# Altium schematic sheet [10]USBSPIBridge.SchDoc
size A4
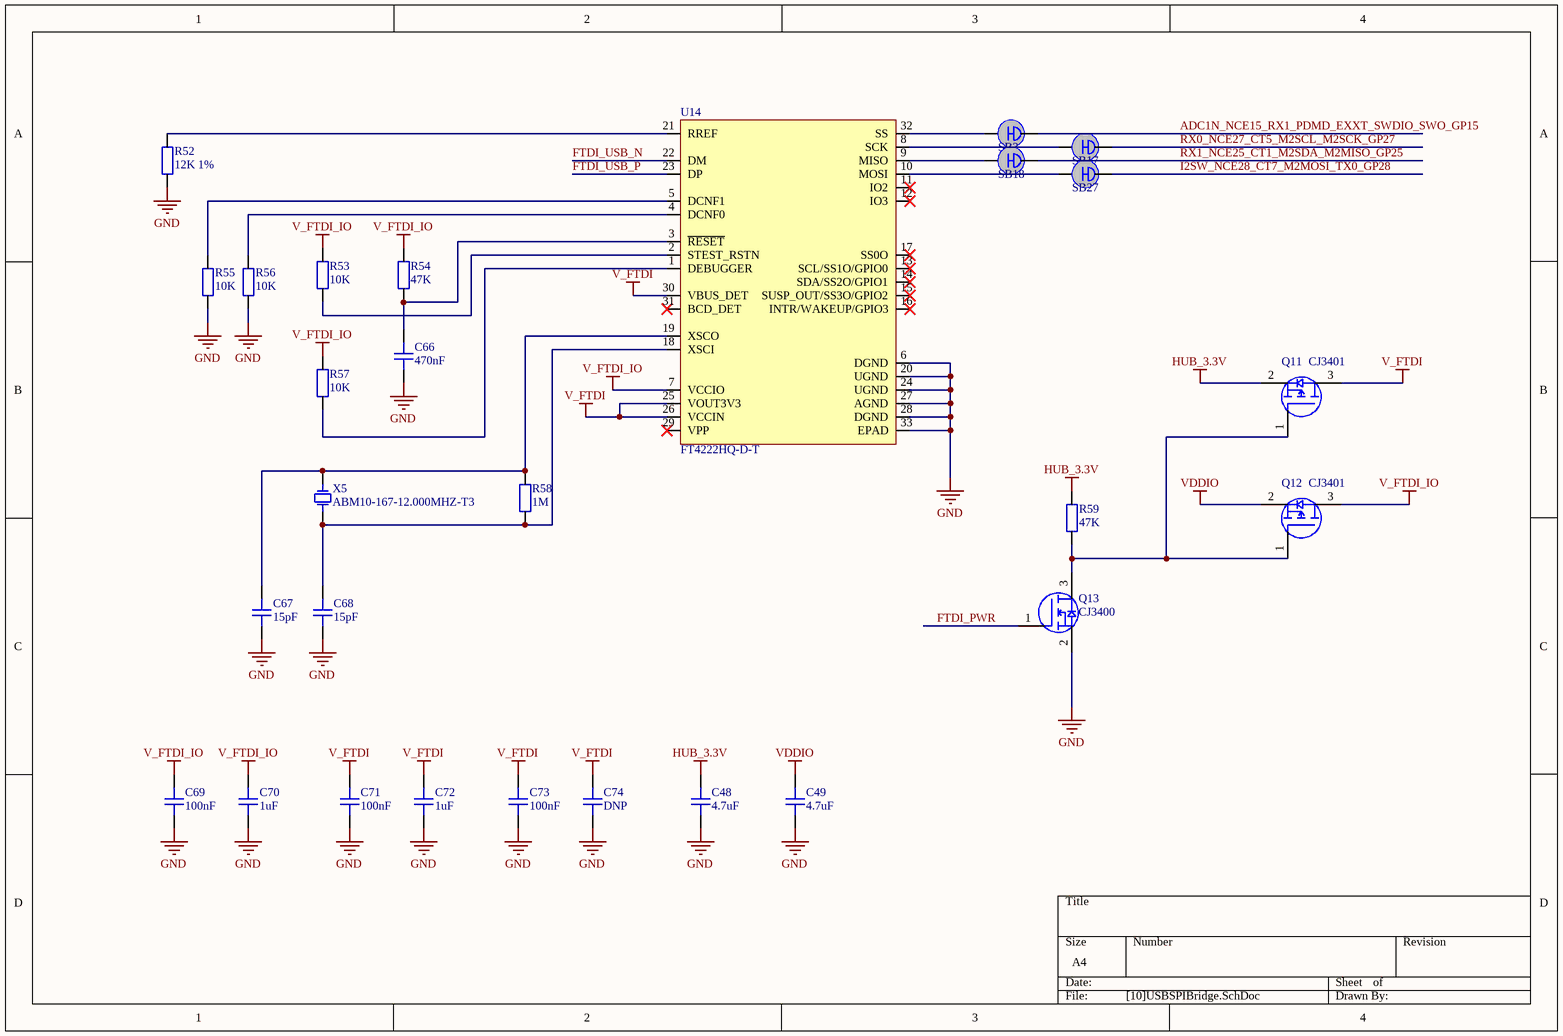
[diagram p0: [10]USBSPIBridge.SchDoc]

## Parts
C48  4.7uF  [CAPC1005L]
C49  4.7uF  [CAPC1005L]
C66  470nF  [CAPC1005L]
C67  15pF  [CAPC1005L]
C68  15pF  [CAPC1005L]
C69  100nF  [CAPC1005L]
C70  1uF  [CAPC1005L]
C71  100nF  [CAPC1005L]
C72  1uF  [CAPC1005L]
C73  100nF  [CAPC1005L]
C74  DNP  [CAPC1005L]
Q11  CJ3401  [SOT23-3L]
Q12  CJ3401  [SOT23-3L]
Q13  CJ3400  [SOT23-3L]
R52  12K 1%  [RESC1005L]
R53  10K  [RESC1005L]
R54  47K  [RESC1005L]
R55  10K  [RESC1005L]
R56  10K  [RESC1005L]
R57  10K  [RESC1005L]
R58  1M  [RESC1005L]
R59  47K  [RESC1005L]
SB3  SBS  [SBS]  (value not drawn)  (net tie, no BOM)
SB17  SBS  [SBS]  (value not drawn)  (net tie, no BOM)
SB18  SBS  [SBS]  (value not drawn)  (net tie, no BOM)
SB27  SBS  [SBS]  (value not drawn)  (net tie, no BOM)
U14  FT4222HQ-D-T  [QFN50P500X500-32W2N]
X5  ABM10-167-12.000MHZ-T3  [OSCCC200X250X100]

## Nets
GND: C48.1 C49.1 C66.1 C67.2 C68.2 C69.1 C70.1 C71.1 C72.1 C73.1 C74.1 Q13.2 R52.1 R55.1 R56.1 U14.6(DGND) U14.20(UGND) U14.24(UGND) U14.27(AGND) U14.28(DGND) U14.33(EPAD) X5.2 X5.4
HUB_3.3V: C48.2 Q11.2 R59.2
V_FTDI: C71.2 C72.2 C73.2 C74.2 Q11.3 U14.25(VOUT3V3) U14.26(VCCIN) U14.30(VBUS_DET)
V_FTDI_IO: C69.2 C70.2 Q12.3 R53.2 R54.2 R57.2 U14.7(VCCIO)
VDDIO: C49.2 Q12.2
ADC1N_NCE15_RX1_PDMD_EXXT_SWDIO_SWO_GP15: SB3.2
FTDI_PWR: Q13.1
FTDI_USB_N: U14.22(DM)
FTDI_USB_P: U14.23(DP)
I2SW_NCE28_CT7_M2MOSI_TX0_GP28: SB27.2
RX0_NCE27_CT5_M2SCL_M2SCK_GP27: SB17.2
RX1_NCE25_CT1_M2SDA_M2MISO_GP25: SB18.2
NetC66_2: C66.2 R54.1 U14.3(~{RESET})
NetC67_1: C67.1 R58.2 U14.19(XSCO) X5.1
NetC68_1: C68.1 R58.1 U14.18(XSCI) X5.3
NetQ11_1: Q11.1 Q12.1 Q13.3 R59.1
NetR52_2: R52.2 U14.21(RREF)
NetR53_1: R53.1 U14.2(STEST_RSTN)
NetR55_2: R55.2 U14.5(DCNF1)
NetR56_2: R56.2 U14.4(DCNF0)
NetR57_1: R57.1 U14.1(DEBUGGER)
NetSB3_1: SB3.1 U14.32(SS)
NetSB17_1: SB17.1 U14.8(SCK)
NetSB18_1: SB18.1 U14.9(MISO)
NetSB27_1: SB27.1 U14.10(MOSI)

Not connected (* = marked no-connect by the designer): U14 11(IO2)* 12(IO3)* 13(SCL/SS1O/GPIO0)* 14(SDA/SS2O/GPIO1)* 15(SUSP_OUT/SS3O/GPIO2)* 16(INTR/WAKEUP/GPIO3)* 17(SS0O)* 29(VPP)* 31(BCD_DET)*

## Library data of the parts
C48 C49 C66-C74 = CAP_CHP: Surface Mount Unpolarized Capacitor
Q11 Q12 = MOS_P: P-Channel MOSFET
Q13 = MOS_N: N-Channel MOSFET
R52-R59 = RES_CHP: Surface Mount Resistor
SB3 SB17 SB18 SB27 = SBS: Short-circuit soldering bridge
U14 = FT4222: FT4222H USB2.0 TO QUADSPI/I2C BRIDGE IC
X5 = XTAL_SMD_4PIN: Surface Mount Crystal